# Altium schematic sheet RemoteCtrl-V2.SchDoc
size A4
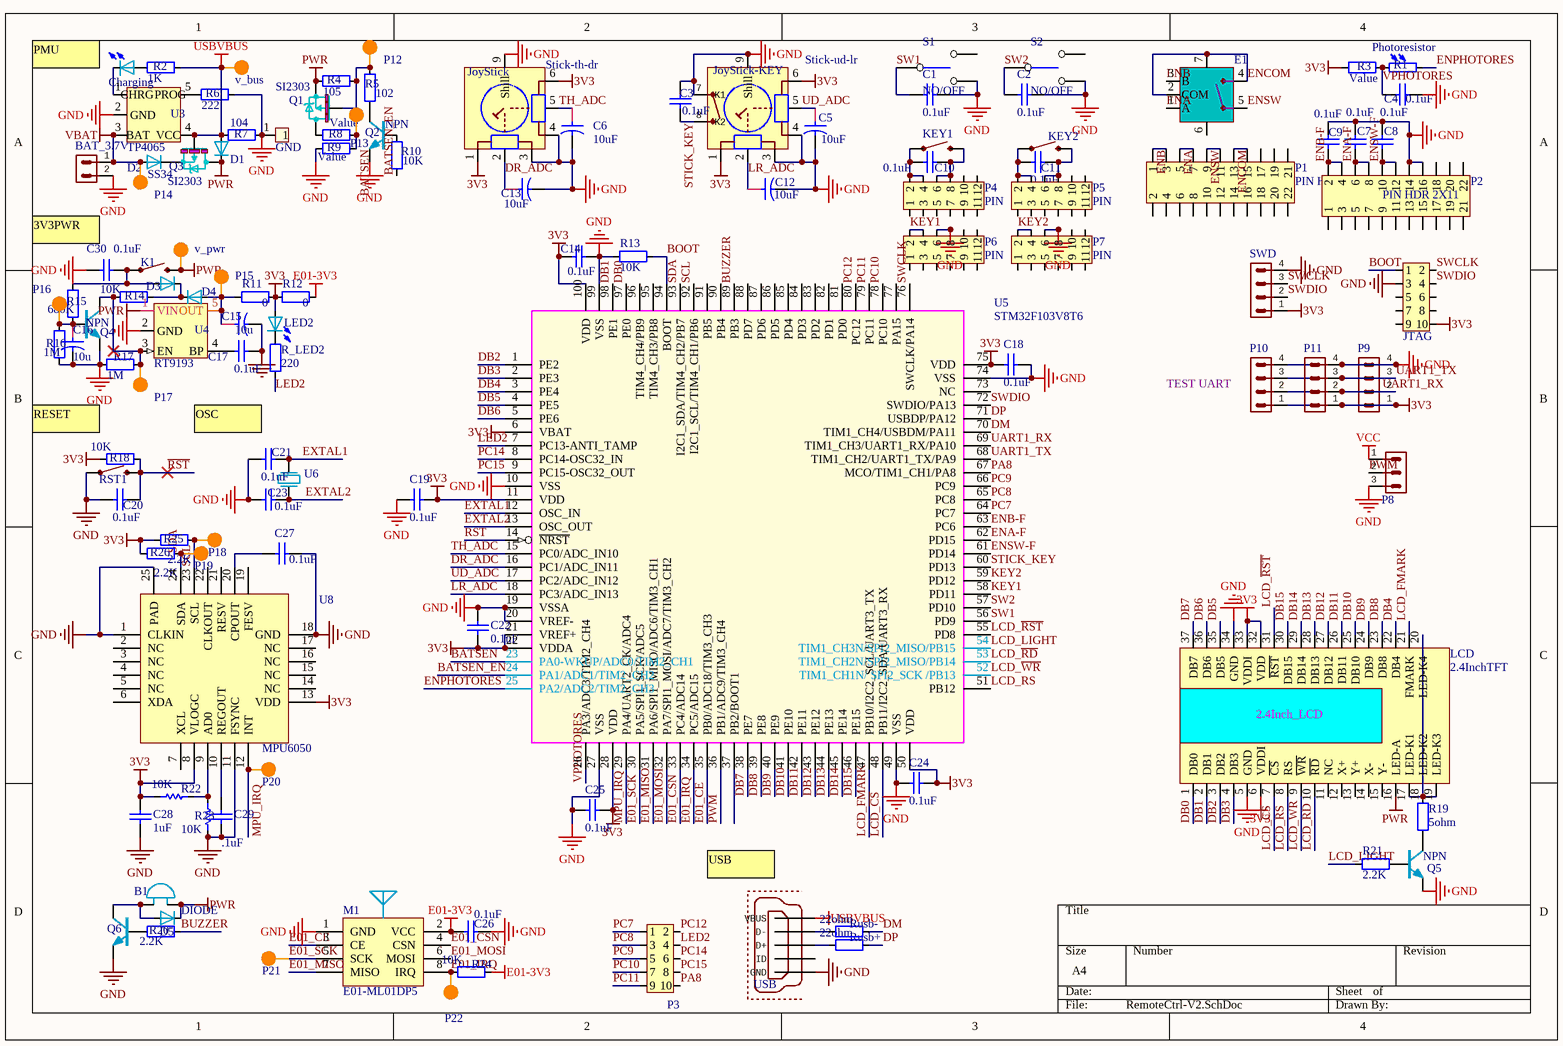
[diagram p0: RemoteCtrl-V2.SchDoc]

## Parts
B1  BUZZER  [BUZZER-HIGHER]  (value not drawn)
BAT_3.7V  PIN HDR 1x2  [XH2_54-2P-R]  (value not drawn)
C1  0.1uF  [0805-CAP]
C2  0.1uF  [0805-CAP]
C3  0.1uF  [0805-CAP]
C4  0.1uF  [0805-CAP]
C5  10uF  [RB2.0*5*11-H]
C6  10uF  [RB2.0*5*11-H]
C7  0.1uF  [0805-CAP]
C8  0.1uF  [0805-CAP]
C9  0.1uF  [0805-CAP]
C10  0.1uF  [0805-CAP]
C11  0.1uF  [0805-CAP]
C12  10uF  [RB2.0*5*11-H]
C13  10uF  [RB2.0*5*11-H]
C14  0.1uF  [0805-CAP]
C15  10u  [TAJ-A(1206)[3216]]
C16  10u  [CAP 1.5*4*8-H]
C17  0.1uF  [0805-CAP]
C18  0.1uF  [0805-CAP]
C19  0.1uF  [0805-CAP]
C20  0.1uF  [0805-CAP]
C21  0.1uF  [0805-CAP]
C22  0.1uF  [0805-CAP]
C23  0.1uF  [0805-CAP]
C24  0.1uF  [0805-CAP]
C25  0.1uF  [0805-CAP]
C26  0.1uF  [0805-CAP]
C27  0.1uF  [0805-CAP]
C28  1uF  [0805-CAP]
C29  .1uF  [0805-CAP]
C30  0.1uF  [0603-CAP]
Charging  LED  [LED-3MM]  (value not drawn)
D1  SS34  [SMA-S(DO-214AC)]  (value not drawn)
D2  SS34  [SMA-S(DO-214AC)]
D3  DIODE  [DO-41]  (value not drawn)
D4  DIODE  [DO-41]  (value not drawn)
D5  DIODE  [DO-41]
E1  ENCODER-12X12  [EC11-L]  (value not drawn)
GND  voltage  [PIN1*1]  (value not drawn)
JTAG  votage  [PIN-HDR-2X5]  (value not drawn)
K1  KEY_2PIN  [KEY-SMD-2P-1]  (value not drawn)
KEY1  KEY_2PIN  [KEY DIP-6*6*4.3]  (value not drawn)
KEY2  KEY_2PIN  [KEY DIP-6*6*4.3]  (value not drawn)
LCD  2.4InchTFT  [LCD-2.4Inch]
LED2  LED  [0805-LED]  (value not drawn)
M1  E01-ML01DP5  [E01-ML01DP5]
P1  PIN HDR 2X11  [PIN-SLOT-MALE-2x11]
P2  PIN HDR 2X11  [PIN-SLOT-FMALE-2X11]
P3  votage  [HDR1.27 2x5-SMD-male]  (value not drawn)
P4  PIN  [PIN-SLOT-MALE-2X6]
P5  PIN  [PIN-SLOT-MALE-2X6]
P6  PIN  [PIN-SLOT-FMALE-2X6]
P7  PIN  [PIN-SLOT-FMALE-2X6]
P8  voltage  [PIN3*1]  (value not drawn)
P9  PIN HDR 1x4  [SH1.0 S-W-4P]  (value not drawn)
P10  PIN HDR 1x4  [PIN4*1]  (value not drawn)
P11  PIN HDR 1x4  [DF13C-4P-1.25V]  (value not drawn)
P12  voltage  [TEST_P]  (value not drawn)
P13  voltage  [TEST_P]  (value not drawn)
P14  voltage  [TEST_P]  (value not drawn)
P15  voltage  [TEST_P]  (value not drawn)
P16  voltage  [TEST_P]  (value not drawn)
P17  voltage  [TEST_P]  (value not drawn)
P18  voltage  [TEST_P]  (value not drawn)
P19  voltage  [TEST_P]  (value not drawn)
P20  voltage  [TEST_P]  (value not drawn)
P21  voltage  [TEST_P]  (value not drawn)
P22  voltage  [TEST_P]  (value not drawn)
Q1  SI2303  [SOT-23]
Q2  NPN  [TO-92]
Q3  SI2303  [SOT-23]
Q4  NPN  [TO-92]
Q5  NPN  [TO-92]
Q6  NPN  [TO-92]  (value not drawn)
R1  Photoresistor  [PhotoresistorGL55]
R2  1K  [0805-RES]
R3  Value  [AXIAL 10mm]
R4  105  [0805-RES]
R5  102  [0805-RES]
R6  222  [0805-RES]
R7  104  [0805-RES]
R8  Value  [0805-RES]
R9  Value  [0805-RES]
R10  10K  [0805-RES]
R11  0  [AXIAL 5mm]
R12  0  [AXIAL 5mm]
R13  10K  [0805-RES]
R14  10K  [AXIAL 10mm]
R15  680K  [AXIAL 10mm]
R16  1M  [AXIAL 15]
R17  1M  [AXIAL 10mm]
R18  10K  [0805-RES]
R19  5ohm  [AXIAL 10mm]
R20  2.2K  [0603-Res]
R21  2.2K  [0805-RES]
R22  10K  [0805-RES]
R23  10K  [0805-RES]
R24  10K  [0603-Res]
R25  2.2K  [0805-RES]
R26  2.2K  [0805-RES]
R_LED2  220  [0805-RES]
RST1  KEY_2PIN  [KEY DIP-6*6*4.3]  (value not drawn)
Rusb+  22ohm  [0603-Res]
Rusb-  22ohm  [0603-Res]
S1  NO/OFF  [SWITCH_N]
S2  NO/OFF  [SWITCH_N]
Stick-th-dr  JoyStick  [JoyStick-Small]
Stick-ud-lr  JoyStick-KEY  [JoyStick-Medium]
SWD  PIN HDR 1x4  [PIN4*1]  (value not drawn)
U3  TP4065  [SOT23-5]
U4  RT9193  [SOT23-5]
U5  STM32F103V8T6  [LQFP-100-L]
U6  XTAL-2PIN  [XTAL-49S_P]  (value not drawn)
U8  MPU6050  [QFN-24]
USB  USB  [USB_MICRO-DIP]  (value not drawn)
v_bus  voltage  [TEST_P]  (value not drawn)
v_pwr  voltage  [TEST_P]  (value not drawn)

## Nets
3V3: C14.1 C18.1 C19.1 C22.1 C24.2 C25.2 C28.2 JTAG.10 LCD.6(VDDI) LCD.32(VDD) LCD.33(VDDI) LED2.A P9.1 P10.1 P11.1 R3.2 R11.2 R12.1 R18.1 R22.1 R25.1 R26.1 Stick-th-dr.1 Stick-th-dr.6 Stick-ud-lr.1 Stick-ud-lr.6 SWD.1 U5.6(VBAT) U5.11(VDD) U5.21(VREF+) U5.22(VDDA) U5.28(VDD) U5.50(VDD) U5.75(VDD) U5.100(VDD) U8.8(VLOGC) U8.13(VDD)
E01-3V3: C26.2 M1.2(VCC) R12.2 R24.2
GND: BAT_3.7V.2 C1.2 C2.2 C3.2 C4.1 C5.C(K) C6.C(K) C7.2 C8.1 C9.2 C12.C(K) C13.C(K) C14.2 C15.C(K) C16.C(K) C17.2 C18.2 C19.2 C20.2 C21.1 C22.2 C23.1 C24.1 C25.1 C26.1 C27.2 C28.1 C29.2 C30.1 GND.1 JTAG.3 LCD.5(GND) LCD.34(GND) M1.1(GND) P2.14 P2.16 P6.6 P6.8 P7.6 P7.8 P8.3 P9.4 P10.4 P11.4 Q2.1 Q4.1 Q5.1 Q6.1 R6.2 R7.2 R9.2 R13.2 R16.1 R17.2 R23.1 RST1.1 S1.3 S2.3 Stick-th-dr.3 Stick-th-dr.4 Stick-th-dr.9(Shill) Stick-ud-lr.3 Stick-ud-lr.4 Stick-ud-lr.7(K1) Stick-ud-lr.9(Shill) SWD.4 U3.2(GND) U4.2(GND) U5.10(VSS) U5.19(VSSA) U5.20(VREF-) U5.27(VSS) U5.49(VSS) U5.74(VSS) U5.99(VSS) U8.1(CLKIN) U8.11(FSYNC) U8.18(GND) U8.25(PAD) USB.GND
PWR: B1.2 D1.C D5.C K1.2 LCD.16(LED-A) Q1.2(S) Q3.3(D) R4.1 U4.1(VIN) v_pwr.1
USBVBUS: D1.A Q3.1(G) R2.2 R7.1 U3.4(VCC) USB.VBUS v_bus.1
VBAT: BAT_3.7V.1 D2.A P14.1 U3.3(BAT)
VCC: P8.1
BATSEN: P13.1 R8.1 R9.1 U5.23(PA0-WKUP/ADC0/TIM2_CH1)
BATSEN_EN: R10.2 U5.24(PA1/ADC1/TIM2_CH2)
BOOT: JTAG.1 R13.1 U5.94(BOOT)
BUZZER: R20.2 U5.89(PB3)
DB0: LCD.1(DB0) U5.97(PE0)
DB1: LCD.2(DB1) U5.98(PE1)
DB2: LCD.3(DB2) U5.1(PE2)
DB3: LCD.4(DB3) U5.2(PE3)
DB4: LCD.22(DB4) U5.3(PE4)
DB5: LCD.35(DB5) U5.4(PE5)
DB6: LCD.36(DB6) U5.5(PE6)
DB7: LCD.37(DB7) U5.38(PE7)
DB8: LCD.23(DB8) U5.39(PE8)
DB9: LCD.24(DB9) U5.40(PE9)
DB10: LCD.25(DB10) U5.41(PE10)
DB11: LCD.26(DB11) U5.42(PE11)
DB12: LCD.27(DB12) U5.43(PE12)
DB13: LCD.28(DB13) U5.44(PE13)
DB14: LCD.29(DB14) U5.45(PE14)
DB15: LCD.30(DB15) U5.46(PE15)
DM: Rusb-.2 U5.70(TIM1_CH4/USBDM/PA11)
DP: Rusb+.2 U5.71(USBDP/PA12)
DR_ADC: C13.A Stick-th-dr.2 U5.16(PC1/ADC_IN11)
E01_CE: M1.3(CE) U5.35(PB0/ADC18/TIM3_CH3)
E01_CSN: M1.4(CSN) U5.33(PC4/ADC14)
E01_IRQ: M1.8(IRQ) P22.1 R24.1 U5.34(PC5/ADC15)
E01_MISO: M1.7(MISO) U5.31(PA6/SPI1_MISO/ADC6/TIM3_CH1)
E01_MOSI: M1.6(MOSI) U5.32(PA7/SPI1_MOSI/ADC7/TIM3_CH2)
E01_SCK: M1.5(SCK) P21.1 U5.30(PA5/SPI1_SCK/ADC5)
ENA: E1.1(A) P1.5 P1.7
ENA-F: C7.1 P2.6 P2.8 U5.62(PD15)
ENB: E1.3(B) P1.1 P1.3
ENB-F: C9.1 P2.2 P2.4 U5.63(PC6)
ENCOM: E1.2(COM) E1.4(key) E1.7(shell) P1.13 P1.15
ENPHOTORES: R1.2 U5.25(PA2/ADC2/TIM2_CH3)
ENSW: E1.5(key) P1.9 P1.11
ENSW-F: C8.2 P2.10 P2.12 U5.61(PD14)
EXTAL1: C21.2 U5.12(OSC_IN) U6.2
EXTAL2: C23.2 U5.13(OSC_OUT) U6.1
KEY1: P6.2 P6.4 U5.58(PD11)
KEY2: P7.2 P7.4 U5.59(PD12)
LCD_~{CS}: LCD.7(~{CS}) U5.48(PB11/I2C2_SDA/UART3_RX)
LCD_FMARK: LCD.21(FMARK) U5.47(PB10/I2C2_SCL/UART3_TX)
LCD_LIGHT: R21.1 U5.54(TIM1_CH3N/SPI2_MISO/PB15)
LCD_~{RD}: LCD.10(~{RD}) U5.53(TIM1_CH2N/SPI2_MISO/PB14)
LCD_~{RST}: LCD.31(~{RST}) U5.55(PD8)
LCD_RS: LCD.8(RS) U5.51(PB12)
LCD_~{WR}: LCD.9(~{WR}) U5.52(TIM1_CH1N/_SPI2_SCK_/PB13)
LED2: P3.4 R_LED2.2 U5.7(PC13-ANTI_TAMP)
LR_ADC: C12.A Stick-ud-lr.2 U5.18(PC3/ADC_IN13)
MPU_IRQ: P20.1 U5.29(PA4/UART2_CK/ADC4) U8.12(INT)
PA8: P3.10 U5.67(MCO/TIM1_CH1/PA8)
PC7: P3.1 U5.64(PC7)
PC8: P3.3 U5.65(PC8)
PC9: P3.5 U5.66(PC9)
PC10: P3.7 U5.78(PC10)
PC11: P3.9 U5.79(PC11)
PC12: P3.2 U5.80(PC12)
PC14: P3.6 U5.8(PC14-OSC32_IN)
PC15: P3.8 U5.9(PC15-OSC32_OUT)
PWM: P8.2 U5.36(PB1/ADC9/TIM3_CH4)
~{RST}: C20.1 R18.2 RST1.2 U5.14(~{NRST})
SCL: P18.1 R25.2 U5.92(I2C1_SCL/TIM4_CH1/PB6) U8.23(SCL)
SDA: P19.1 R26.2 U5.93(I2C1_SDA/TIM4_CH2/PB7) U8.24(SDA)
STICK_KEY: C3.1 Stick-ud-lr.8(K2) U5.60(PD13)
SW1: C1.1 S1.2 U5.56(PD9)
SW2: C2.1 S2.2 U5.57(PD10)
SWCLK: JTAG.2 SWD.3 U5.76(SWCLK/PA14)
SWDIO: JTAG.4 SWD.2 U5.72(SWDIO/PA13)
TH_ADC: C6.A Stick-th-dr.5 U5.15(PC0/ADC_IN10)
UART1_RX: P9.2 P10.2 P11.2 U5.69(TIM1_CH3/UART1_RX/PA10)
UART1_TX: P9.3 P10.3 P11.3 U5.68(TIM1_CH2/UART1_TX/PA9)
UD_ADC: C5.A Stick-ud-lr.5 U5.17(PC2/ADC_IN12)
VPHOTORES: C4.2 R1.1 R3.1 U5.26(PA3/ADC3/TIM2_CH4)
NetB1_1: B1.1 D5.A Q6.3
NetC10_1: C10.1 KEY1.2 P4.6 P4.8
NetC10_2: C10.2 KEY1.1 P4.2 P4.4
NetC11_1: C11.1 KEY2.2 P5.6 P5.8
NetC11_2: C11.2 KEY2.1 P5.2 P5.4
NetC15_A: C15.A D4.A P15.1 R11.1 U4.5(OUT)
NetC16_A: C16.A P16.1 Q4.2 R15.1 R16.2
NetC17_1: C17.1 U4.4(BP)
NetC27_1: C27.1 U8.20(CPOUT)
NetC29_1: C29.1 U8.10(REGOUT)
NetC30_2: C30.2 D3.A K1.1 R15.2
NetCharging_A: Charging.A R2.1
NetCharging_C: Charging.C U3.1(CHRG)
NetD2_C: D2.C Q3.2(S)
NetD3_C: D3.C D4.C R14.1
NetLCD_17: LCD.17(LED-K1) LCD.18(LED-K2) LCD.19(LED-K3) LCD.20(LED-K4) R19.2
NetLED2_C: LED2.C R_LED2.1
NetP12_1: P12.1 Q1.1(G) R4.2 R5.1
NetP17_1: P17.1 Q4.3 R14.2 R17.1 U4.3(EN)
NetQ1_3: Q1.3(D) R8.2
NetQ2_2: Q2.2 R10.1
NetQ2_3: Q2.3 R5.2
NetQ5_2: Q5.2 R21.2
NetQ5_3: Q5.3 R19.1
NetQ6_2: Q6.2 R20.1
NetR6_1: R6.1 U3.5(PROG)
NetR22_2: R22.2 R23.2 U8.9(AD0)
NetRusb+_1: Rusb+.1 USB.D+
NetRusb-_1: Rusb-.1 USB.D-

Not connected (* = marked no-connect by the designer): E1 6(SHELL); JTAG 5 6 7 8 9; LCD 11(NC) 12(X+) 13(Y+) 14(X-) 15(Y-); P1 2 4 6 8 10 12 14 16 17 18 19 20 21 22; P2 1 3 5 7 9 11 13 15 17 18 19 20 21 22; P4 1 3 5 7 9 10 11 12; P5 1 3 5 7 9 10 11 12; P6 1 3 5 7 9 10 11 12; P7 1 3 5 7 9 10 11 12; S1 1; S2 1; U5 37(PB2/BOOT1) 73(NC) 77(PA15) 81(PD0) 82(PD1) 83(PD2) 84(PD3) 85(PD4) 86(PD5) 87(PD6) 88(PD7) 90(PB4) 91(PB5) 95(TIM4_CH3/PB8) 96(TIM4_CH4/PB9); U8 2(NC) 3(NC) 4(NC) 5(NC) 6(XDA) 7(XCL) 14(NC) 15(NC) 16(NC) 17(NC) 19(FESV) 21(RESV) 22(CLKOUT); USB ID

## Notes on the sheet
- (near Charging) PMU
- 3V3PWR
- (near P10) TEST UART
- RESET
- OSC
- USB
- (in symbol LCD-2.4Inch) 2.4Inch_LCD

## Library data of the parts
BAT_3.7V = PIN HDR 1x2: Header, 2-Pin; LatestRevisionDate: 17-Jul-2002; LatestRevisionNote: Re-released for DXP Platform.; Publisher: Altium Limited
C1-C4 C7-C11 C14 C17-C27 = Cap: 无极性Cap; Voltage: 50V; Published: 8-Jun-2000; LatestRevisionDate: 17-Jul-2002; LatestRevisionNote: Re-released for DXP Platform.; PackageReference: RAD-0.3; Publisher: Altium Limited; PackageDescription: Radial Cap, Thru-Hole; 2 Leads; 0.3 in Pin Spacing; Footprint: 0603; Value: 0.1uF
C5 C12 C13 = Cap_p: Filter Cap
C6 = Cap_p: filter cap
C15 C16 = Cap_p: 有极性Cap
C28 C29 = Cap: 无极性Cap; Voltage: 50V; Value: 0.1uF; Published: 8-Jun-2000; LatestRevisionDate: 17-Jul-2002; LatestRevisionNote: Re-released for DXP Platform.; PackageReference: RAD-0.3; Publisher: Altium Limited; PackageDescription: Radial Cap, Thru-Hole; 2 Leads; 0.3 in Pin Spacing; Footprint: 0603
C30 = Cap: Cap used compress sharp edge of the key buttom; Voltage: 50V; Published: 8-Jun-2000; LatestRevisionDate: 17-Jul-2002; LatestRevisionNote: Re-released for DXP Platform.; PackageReference: RAD-0.3; Publisher: Altium Limited; PackageDescription: Radial Cap, Thru-Hole; 2 Leads; 0.3 in Pin Spacing; Footprint: 0603; Value: 0.1uF
D1 D2 = DIODE
E1 = ENCODER-12X12: 12X12带按键旋转编码器
GND = PIN HDR 1x1
JTAG = PIN HDR 2X5: 2x5pin
LCD = LCD-2.4Inch
M1 = E01-ML01DP5: 无线模块E01-ML01DP5
P1 P2 = PIN HDR 2X11: Header, 11-Pin, Dual row; LatestRevisionDate: 17-Jul-2002; LatestRevisionNote: Re-released for DXP Platform.; Publisher: Altium Limited
P3 = PIN HDR 2X5: 2x5pin backup pin
P4-P7 = PIN HDR 2X6: 2X6PIN
P8 = PIN HDR 1X3
P9-P11 SWD = PIN HDR 1x4: 1x4-Pin-connector; LatestRevisionDate: 17-Jul-2002; LatestRevisionNote: Re-released for DXP Platform.; Publisher: Altium Limited
P12-P22 v_bus v_pwr = TEST: 信号测试点
Q1 Q3 = MOS-P: PMOS
Q2 Q4-Q6 = NPN: NPN三极管
R1 = Photoresistor: Photoresistor,光敏电阻
R2 = RES: Resistor; Published: 8-Jun-2000; LatestRevisionDate: 17-Jul-2002; LatestRevisionNote: Re-released for DXP Platform.; PackageReference: AXIAL-0.4; Publisher: Altium Limited; Value: 1K
R3 R7 R11 R12 R14-R17 = RES: Resistor; Value: 1K; Published: 8-Jun-2000; LatestRevisionDate: 17-Jul-2002; LatestRevisionNote: Re-released for DXP Platform.; PackageReference: AXIAL-0.4; Publisher: Altium Limited
R4 = Res: Resistor used pull gate high; Value: 1K; Published: 8-Jun-2000; LatestRevisionDate: 17-Jul-2002; LatestRevisionNote: Re-released for DXP Platform.; PackageReference: AXIAL-0.4; Publisher: Altium Limited
R5 R8-R10 R13 R_LED2 = Res: Resistor; Value: 1K; Published: 8-Jun-2000; LatestRevisionDate: 17-Jul-2002; LatestRevisionNote: Re-released for DXP Platform.; PackageReference: AXIAL-0.4; Publisher: Altium Limited
R6 = RES: Resistor ctrld the charge amps,see chip reference; Value: 1K; Published: 8-Jun-2000; LatestRevisionDate: 17-Jul-2002; LatestRevisionNote: Re-released for DXP Platform.; PackageReference: AXIAL-0.4; Publisher: Altium Limited
R18 = Res: Pull Resistor; Value: 1K; Published: 8-Jun-2000; LatestRevisionDate: 17-Jul-2002; LatestRevisionNote: Re-released for DXP Platform.; PackageReference: AXIAL-0.4; Publisher: Altium Limited
R19 = RES: LED current limit Resistor; Value: 1K; Published: 8-Jun-2000; LatestRevisionDate: 17-Jul-2002; LatestRevisionNote: Re-released for DXP Platform.; PackageReference: AXIAL-0.4; Publisher: Altium Limited
R20 = Res: NPN drive Resistor; Value: 1K; Published: 8-Jun-2000; LatestRevisionDate: 17-Jul-2002; LatestRevisionNote: Re-released for DXP Platform.; PackageReference: AXIAL-0.4; Publisher: Altium Limited
R21 = RES: NPN drive Resistor; Value: 1K; Published: 8-Jun-2000; LatestRevisionDate: 17-Jul-2002; LatestRevisionNote: Re-released for DXP Platform.; PackageReference: AXIAL-0.4; Publisher: Altium Limited
R22 R23 = Res: Resistor; Published: 8-Jun-2000; LatestRevisionDate: 17-Jul-2002; LatestRevisionNote: Re-released for DXP Platform.; PackageReference: AXIAL-0.3; Publisher: Altium Limited; PackageDescription: Axial Device, Thru-Hole; 2 Leads; 0.3 in Pin Spacing; Footprint: 0603; Value: 10K
R24 = Res: Pull Resistor 芯片内部200k上拉不够; Value: 1K; Published: 8-Jun-2000; LatestRevisionDate: 17-Jul-2002; LatestRevisionNote: Re-released for DXP Platform.; PackageReference: AXIAL-0.4; Publisher: Altium Limited; Footprint: 0603
R25 R26 = Res: IIC Pull Resistor; Value: 1K; Published: 8-Jun-2000; LatestRevisionDate: 17-Jul-2002; LatestRevisionNote: Re-released for DXP Platform.; PackageReference: AXIAL-0.4; Publisher: Altium Limited
Rusb+ Rusb- = Res: USB Resistor; Value: 1K; Published: 8-Jun-2000; LatestRevisionDate: 17-Jul-2002; LatestRevisionNote: Re-released for DXP Platform.; PackageReference: AXIAL-0.4; Publisher: Altium Limited; Footprint: 0603
S1 S2 = SW-SPDT
U3 = TP4065: TP4065-3.7v锂电充电管理芯片
U5 = STM32F103V8T6: V-100PIN,8-64KFLASH,T-LQFP
U6 = XTAL-2PIN: 2PIN(非SMD)晶振
U8 = MPU6050: dscrps三轴陀螺仪加速度计